# Altium schematic sheet IO.SchDoc: IO
size A; Author: Micheal Burin; Revision: 1.0; SheetNumber: 7; SheetTotal: 10
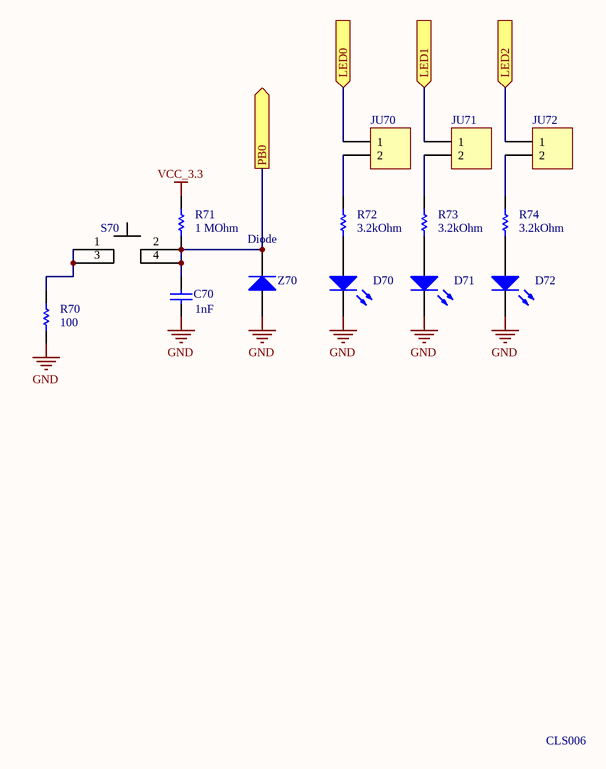
[diagram p0: IO.SchDoc]

## Parts
C70  value 1nF  [0805_CHIP_FP]  (hidden comment: Capacitor_unpolarized_0603)
D70  LED Generic  [LED_FP]  (value not drawn)
D71  LED Generic  [LED_FP]  (value not drawn)
D72  LED Generic  [LED_FP]  (value not drawn)
JU70  Header 2  [HDR1X2]  (value not drawn)
JU71  Header 2  [HDR1X2]  (value not drawn)
JU72  Header 2  [HDR1X2]  (value not drawn)
R70  value 100  [0805_CHIP_FP]  (hidden comment: Resistor_0805)
R71  value 1 MOhm  [0805_CHIP_FP]  (hidden comment: Resistor_0805)
R72  value 3.2kOhm  [0805_CHIP_FP]  (hidden comment: Resistor_0805)
R73  value 3.2kOhm  [0805_CHIP_FP]  (hidden comment: Resistor_0805)
R74  value 3.2kOhm  [0805_CHIP_FP]  (hidden comment: Resistor_0805)
S70  Switch  [Pushbutton]  (value not drawn)
Z70  Diode  [0603_CHIP_FP]

## Ports
LED0 (in), LED1 (in), LED2 (in), PB0 (out)

## Nets
GND: C70.1 D70.2(K) D71.2(K) D72.2(K) R70.1 Z70.2(Cathode)
VCC_3.3: R71.2
LED0: JU70.1 ; port LED0
LED1: JU71.1 ; port LED1
LED2: JU72.1 ; port LED2
PB0: C70.2 R71.1 S70.2 S70.4 Z70.1(Anode) ; port PB0
NetD70_1: D70.1(A) R72.1
NetD71_1: D71.1(A) R73.1
NetD72_1: D72.1(A) R74.1
NetJU70_2: JU70.2 R72.2
NetJU71_2: JU71.2 R73.2
NetJU72_2: JU72.2 R74.2
NetR70_2: R70.2 S70.1 S70.3

## Notes on the sheet
- CLS006

## Library data of the parts
C70 = Capacitor_unpolarized_0603: Manufacturer: Johanson Dielectrics Inc.; Manufacturer Part Number: 500R15N102JV4T; Vendor Part Number: 709-1180-1-ND; Vendor: Digikey; Vendor Description: CAP CER 1000PF 50V C0G/NP0 0805; ComponentLink1Description: Datasheet; ComponentLink1URL: https://www.digikey.com/product-detail/en/johanson-dielectrics-inc/500R15N102JV4T/709-1180-1-ND/1859512; Cost: .30
D70 = LED_generic: Manufacturer: Broadcom Limited; Manufacturer Part Number: HLMP-P156-HK011; Vendor Part Number: 516-4089-1-ND; Vendor: Digikey; Vendor Description: LED RED CLEAR FLAT 2SMD GW; ComponentLink1Description: Datasheet; ComponentLink1URL: https://www.digikey.com/product-detail/en/broadcom-limited/HLMP-P156-HK011/516-4089-1-ND/9178267; Cost: .676
D71 D72 = LED_generic: LED RED CLEAR FLAT 2SMD GW; Manufacturer: Broadcom Limited; Manufacturer Part Number: HLMP-P156-HK011; Vendor Part Number: 516-4089-1-ND; Vendor: Digikey; ComponentLink1Description: Datasheet; ComponentLink1URL: https://www.digikey.com/product-detail/en/broadcom-limited/HLMP-P156-HK011/516-4089-1-ND/9178267; Cost: .676; Vendor Description: LED RED CLEAR FLAT 2SMD GW
JU70-JU72 = Header 2: CONN HEADER .100 SINGL STR 36POS; Vendor Part Number: PRT-00116; Vendor: Digikey; Vendor Description: .100 mil pitch male header x2; ComponentLink1Description: Datasheet; ComponentLink1URL: https://www.digikey.com/product-detail/en/sullins-connector-solutions/PEC36SAAN/S1012E-36-ND/859153; Cost: bulk
R70 = Resistor_0805: Manufacturer: Yageo; Manufacturer Part Number: RC0805FR-07100RL; Vendor Part Number: 311-100CRCT-ND; Vendor: Digikey; Vendor Description: RES SMD 100 OHM 1% 1/8W 0805; ComponentLink1Description: Datasheet; ComponentLink1URL: https://www.digikey.com/product-detail/en/yageo/RC0805FR-07100RL/311-100CRCT-ND/730490; Cost: .10
R71 = Resistor_0805: Manufacturer: Yageo; Manufacturer Part Number: RC0805FR-071ML; Vendor Part Number: 311-1.00MCRCT-ND; Vendor: Digikey; Vendor Description: RES SMD 1M OHM 1% 1/8W 0805; ComponentLink1Description: Datasheet; ComponentLink1URL: https://www.digikey.com/products/en?keywords=311-1.00MCRCT-ND; Cost: .05
R72-R74 = Resistor_0805: Manufacturer: Yageo; Manufacturer Part Number: RC0805FR-073K24L; Vendor Part Number: 311-3.24KCRCT-ND; Vendor: Digikey; Vendor Description: RES SMD 3.24K OHM 1% 1/8W 0805; ComponentLink1Description: Datasheet; ComponentLink1URL: https://www.digikey.com/product-detail/en/yageo/RC0805FR-073K24L/311-3.24KCRCT-ND/730758; Cost: .05
S70 = Pushbutton: Pushbutton Switch; Manufacturer: APEM Inc.; Manufacturer Part Number: MJTP1230; Vendor Part Number: 679-2428-ND; Vendor: Digikey; Vendor Description: SWITCH TACTILE SPST-NO 0.05A 12V; ComponentLink1Description: Datasheet; ComponentLink1URL: https://www.digikey.com/product-detail/en/apem-inc/MJTP1230/679-2428-ND/1798037; Cost: .11
Z70 = Diode: Default Diode; Manufacturer: STMicroelectronics; Manufacturer Part Number: ESDA7P120-1U1M; Vendor Part Number: 497-17159-1-ND; Vendor: Digikey; Vendor Description: TVS DIODE 5.5V 11.5V 1610; ComponentLink1Description: Datasheet; ComponentLink1URL: https://www.digikey.com/product-detail/en/stmicroelectronics/ESDA7P120-1U1M/497-17159-1-ND/6709859; Cost: .38